# Altium schematic sheet can.SchDoc: Gimbal Board CAN
size A4
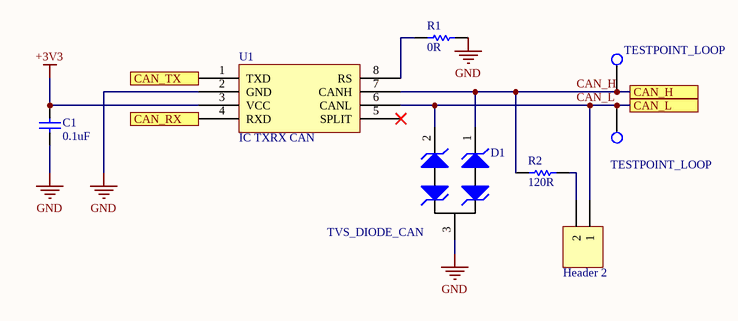
[diagram p0: can.SchDoc]

## Parts
1  Header 2  [HDR1X2]
C1  value 0.1uF  [CAPC0603(1608)55_N]  (hidden comment: CAP_0.1uF_16V_0603)
CANH1  TESTPOINT_LOOP  [TESTPOINT_LOOP]
CANL1  TESTPOINT_LOOP  [TESTPOINT_LOOP]
D1  TVS_DIODE_CAN  [NXP-SOT323-3]
R1  value 0R  [RESC0603(1608)_N]  (hidden comment: RES_0R_0603)
R2  value 120R  [RESC0603(1608)_N]  (hidden comment: RES_120R_0603)
U1  IC TXRX CAN  [LT-S8_N]

## Ports
CAN_H, CAN_L, CAN_RX, CAN_TX

## Nets
+3V3: C1.2 U1.3(VCC)
GND: C1.1 D1.3 R1.2 U1.2(GND)
CAN_H: CANH1.1(=value) D1.1 R2.1 U1.7(CANH) ; port CAN_H
CAN_L: 1.1 CANL1.1(=value) D1.2 U1.6(CANL) ; port CAN_L
CAN_RX: U1.4(RXD) ; port CAN_RX
CAN_TX: U1.1(TXD) ; port CAN_TX
Net1_2: 1.2 R2.2
NetR1_1: R1.1 U1.8(RS)

Not connected (* = marked no-connect by the designer): U1 5(SPLIT)*

## Library data of the parts
1 = Header 2: Header, 2-Pin; LatestRevisionDate: 17-Jul-2002; LatestRevisionNote: Re-released for DXP Platform.; Publisher: Altium Limited
C1 = CAP_0.1uF_16V_0603: CAP CER 0.1UF 16V X7R 0603; Manufacturer: Yageo; MPN: CC0603KRX7R7BB104; Dimensions: 0.063" L x 0.031" W (1.60mm x 0.80mm); Package: 0603 (1608 Metric); Temperature Coefficient: X7R; Voltage Rating: 16V; Digikey Part Number: 311-1088-1-ND
D1 = TVS_DIODE_CAN: TVS DIODE 24V 41V SOT323-3; Manufacturer: Nexperia USA Inc.; MPN: PESD2CAN,215; Package: SC-70, SOT-323; ComponentLink1Description: Datasheet; ComponentLink1URL: https://assets.nexperia.com/documents/data-sheet/PESD1CAN-U.pdf; Digikey Part Number: 1727-3891-1-ND
R1 = RES_0R_0603: RES SMD 0 OHM JUMPER 1/10W 0603; Manufacturer: Yageo; MPN: RC0603JR-070RL; Package: 0603 (1608 Metric); Dimensions: 0.063" L x 0.031" W (1.60mm x 0.80mm); Digikey Part Number: 311-0.0GRCT-ND
R2 = RES_120R_0603: RES SMD 120 OHM 5% 1/10W 0603; Manufacturer: Yageo; MPN: RC0603JR-07120RL; Package: 0603 (1608 Metric); Dimensions: 0.063" L x 0.031" W (1.60mm x 0.80mm); Tolerance: 5%; Digikey Part Number: 311-120GRCT-ND
U1 = LTC2875: IC TXRX CAN 4MBPS 8SO; Manufacturer: Linear Technologies; MPN: LTC2875IS8#PBF; Package: 8-SOIC (0.154", 3.90mm Width); ComponentLink1Description: Datasheet; ComponentLink1URL: https://www.analog.com/media/en/technical-documentation/data-sheets/2875f.pdf; Digikey Part Number: LTC2875IS8#PBF-ND